# EasyEDA Pro project stm32f401rct6v2.eprj, schematic STM32F401RCT6V2W5500

## Sheets
1 P1: Create Date: 2024-03-25; Page Name: P1; Project Name: stm32f401rct6v2; Schematic Name: STM32F401RCT6V2W5500; Update Date: 2024-06-25; Company: 嘉立创EDA; Page Size: A4; Version: V1.0
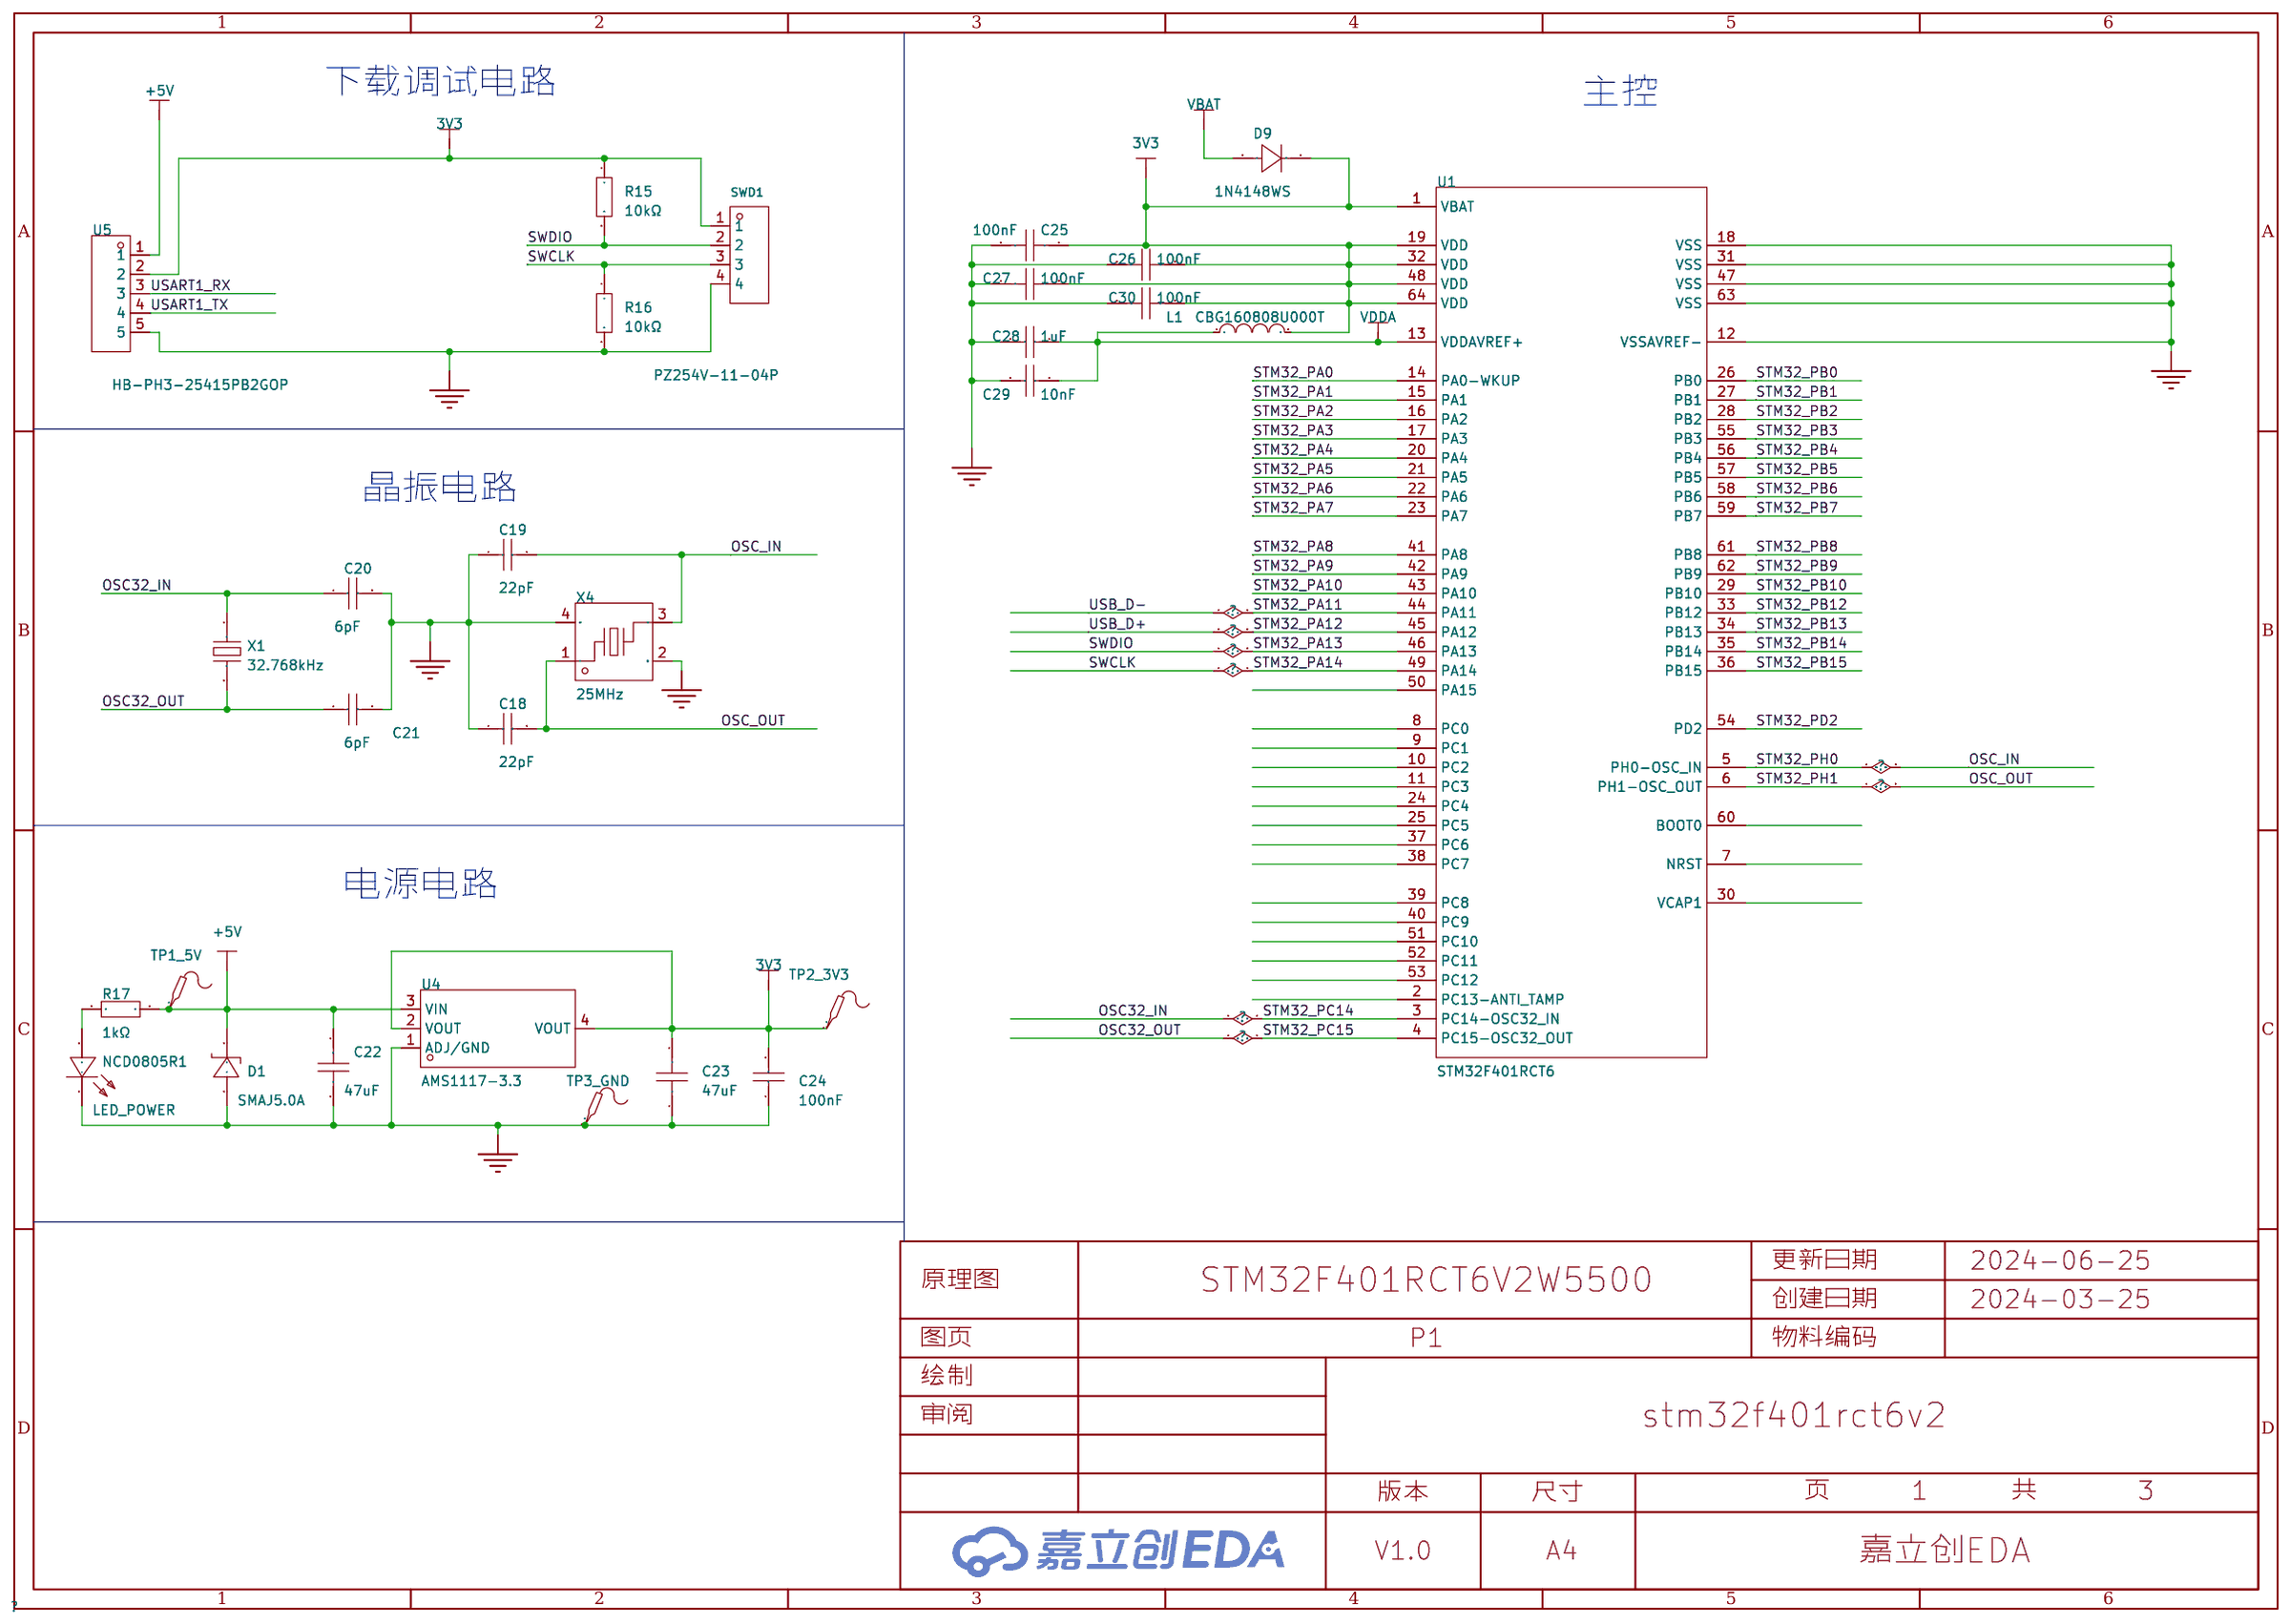
[diagram p1: P1]
2 P2: Page Name: P2; Update Date: 2024-05-12
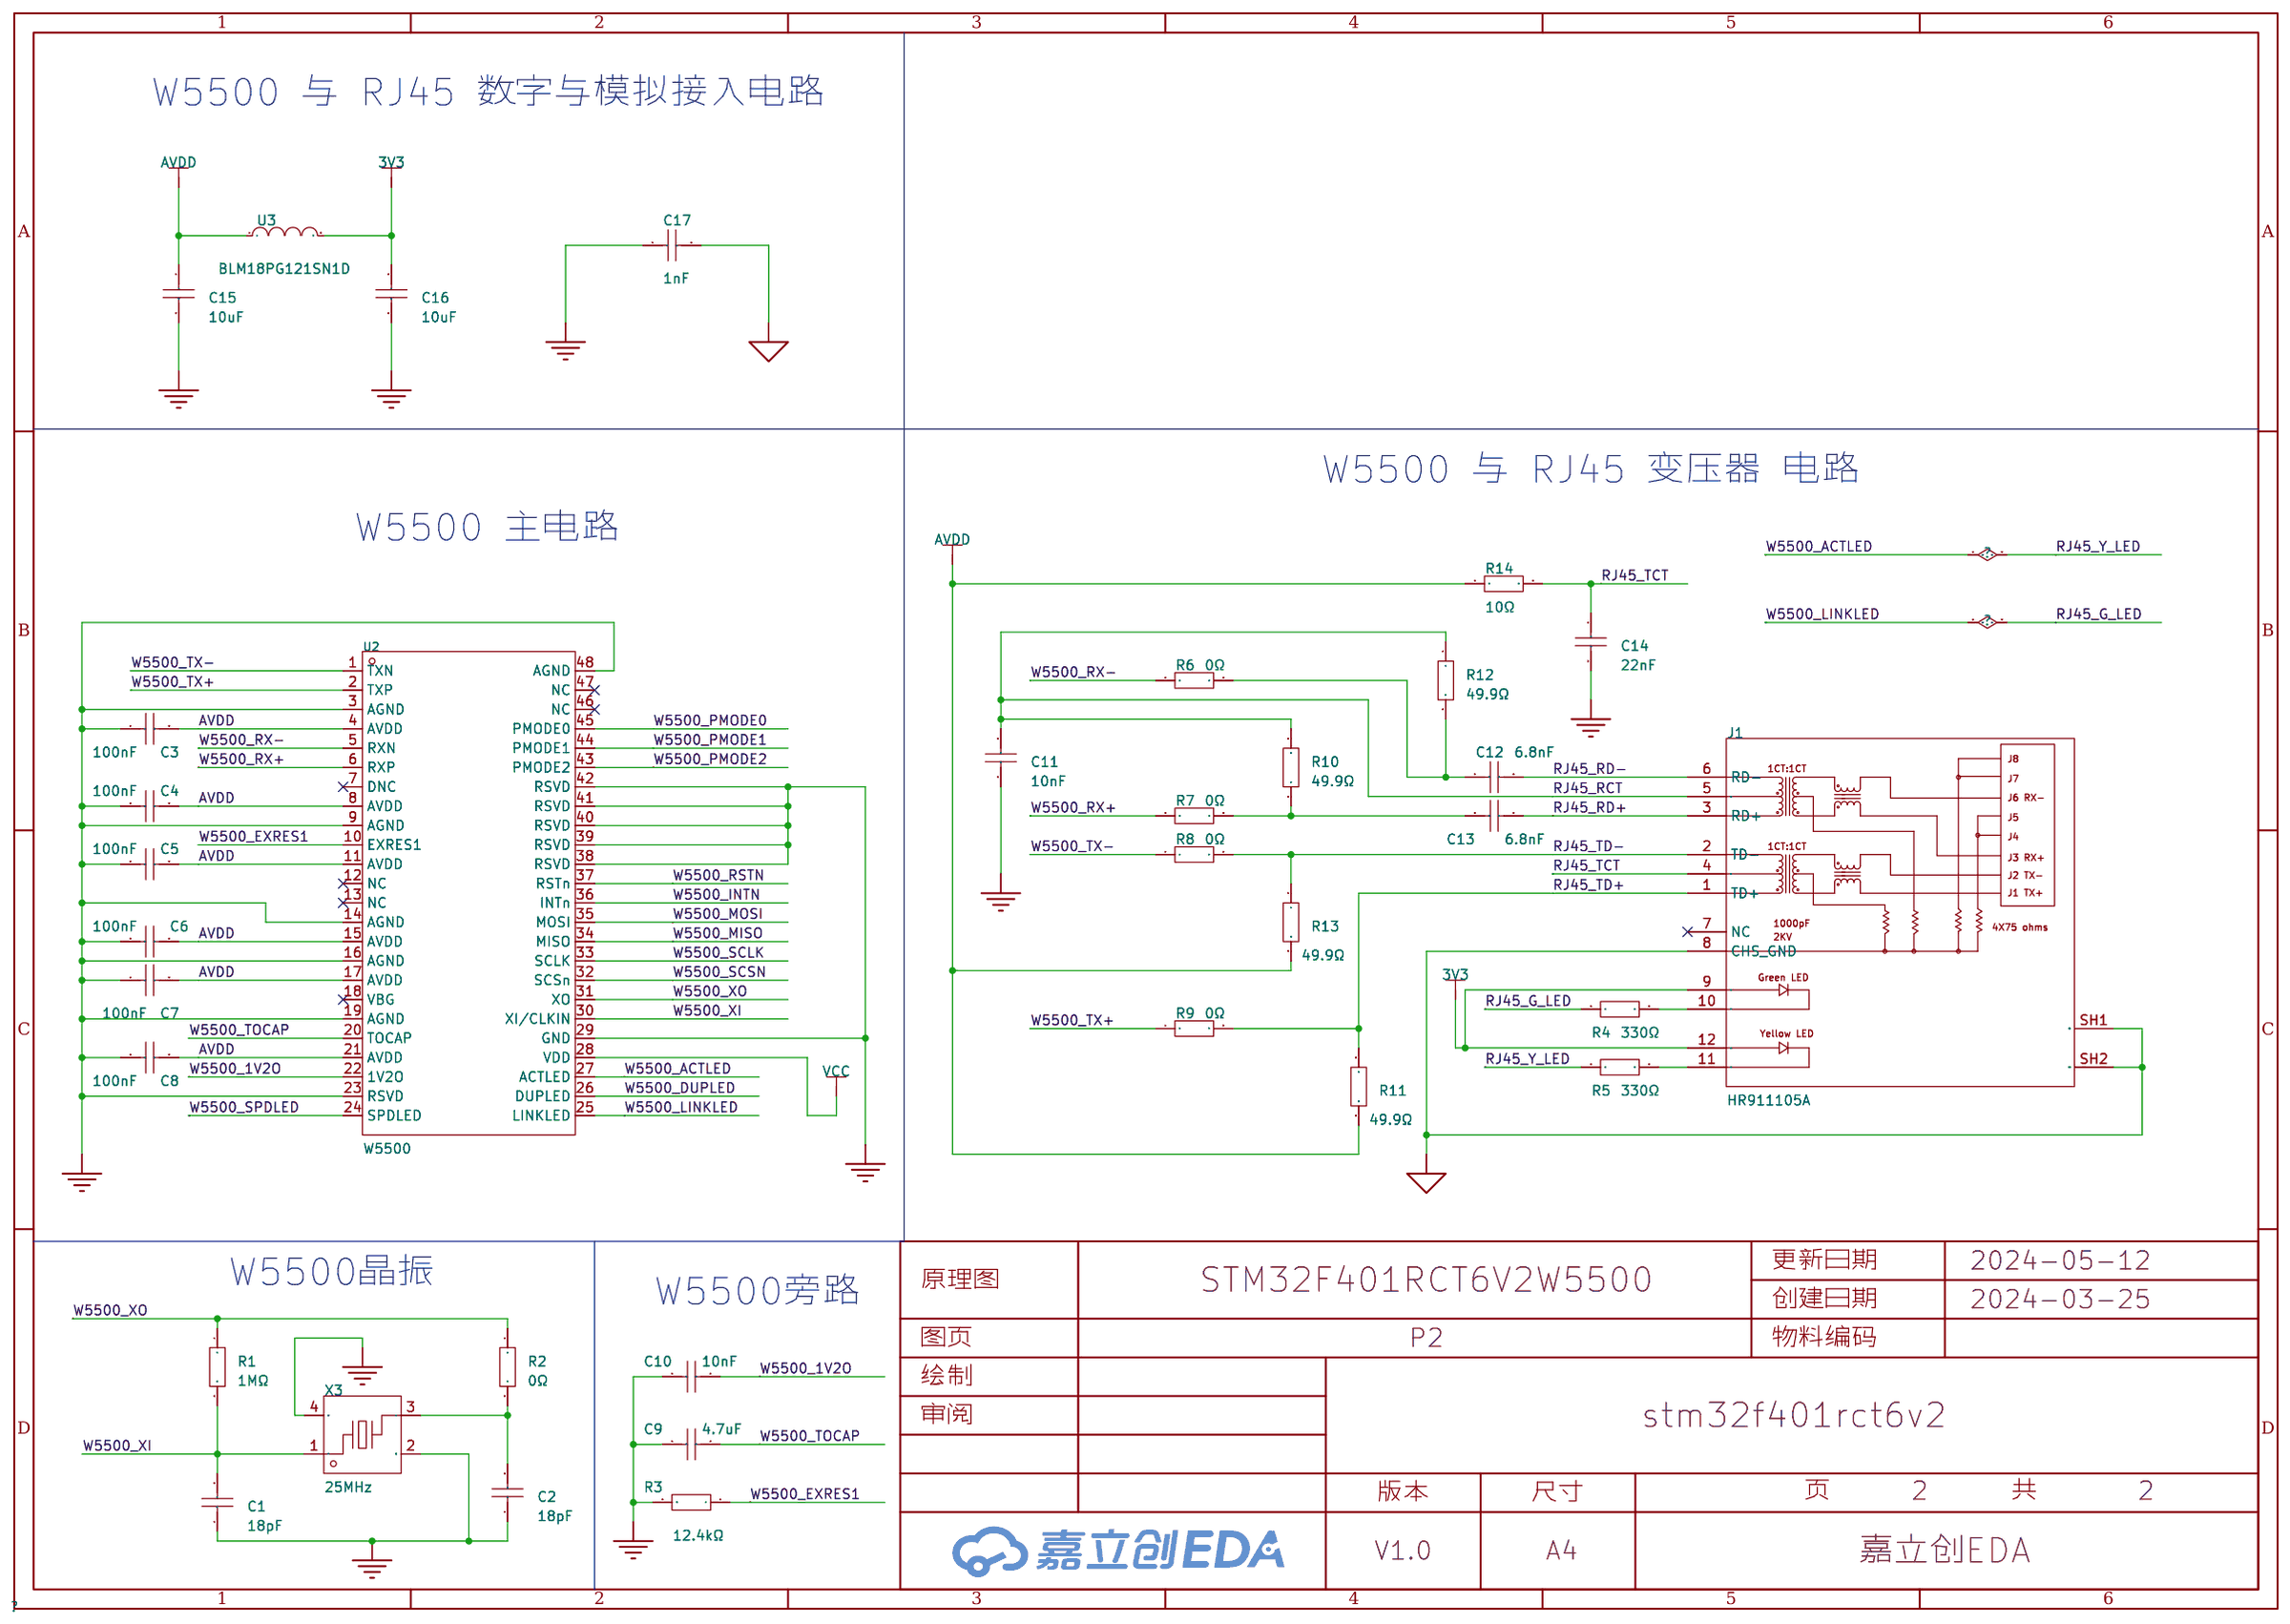
[diagram p2: P2]
3 P3: Create Date: 2024-06-23; Page Name: P3; Update Date: 2024-06-24
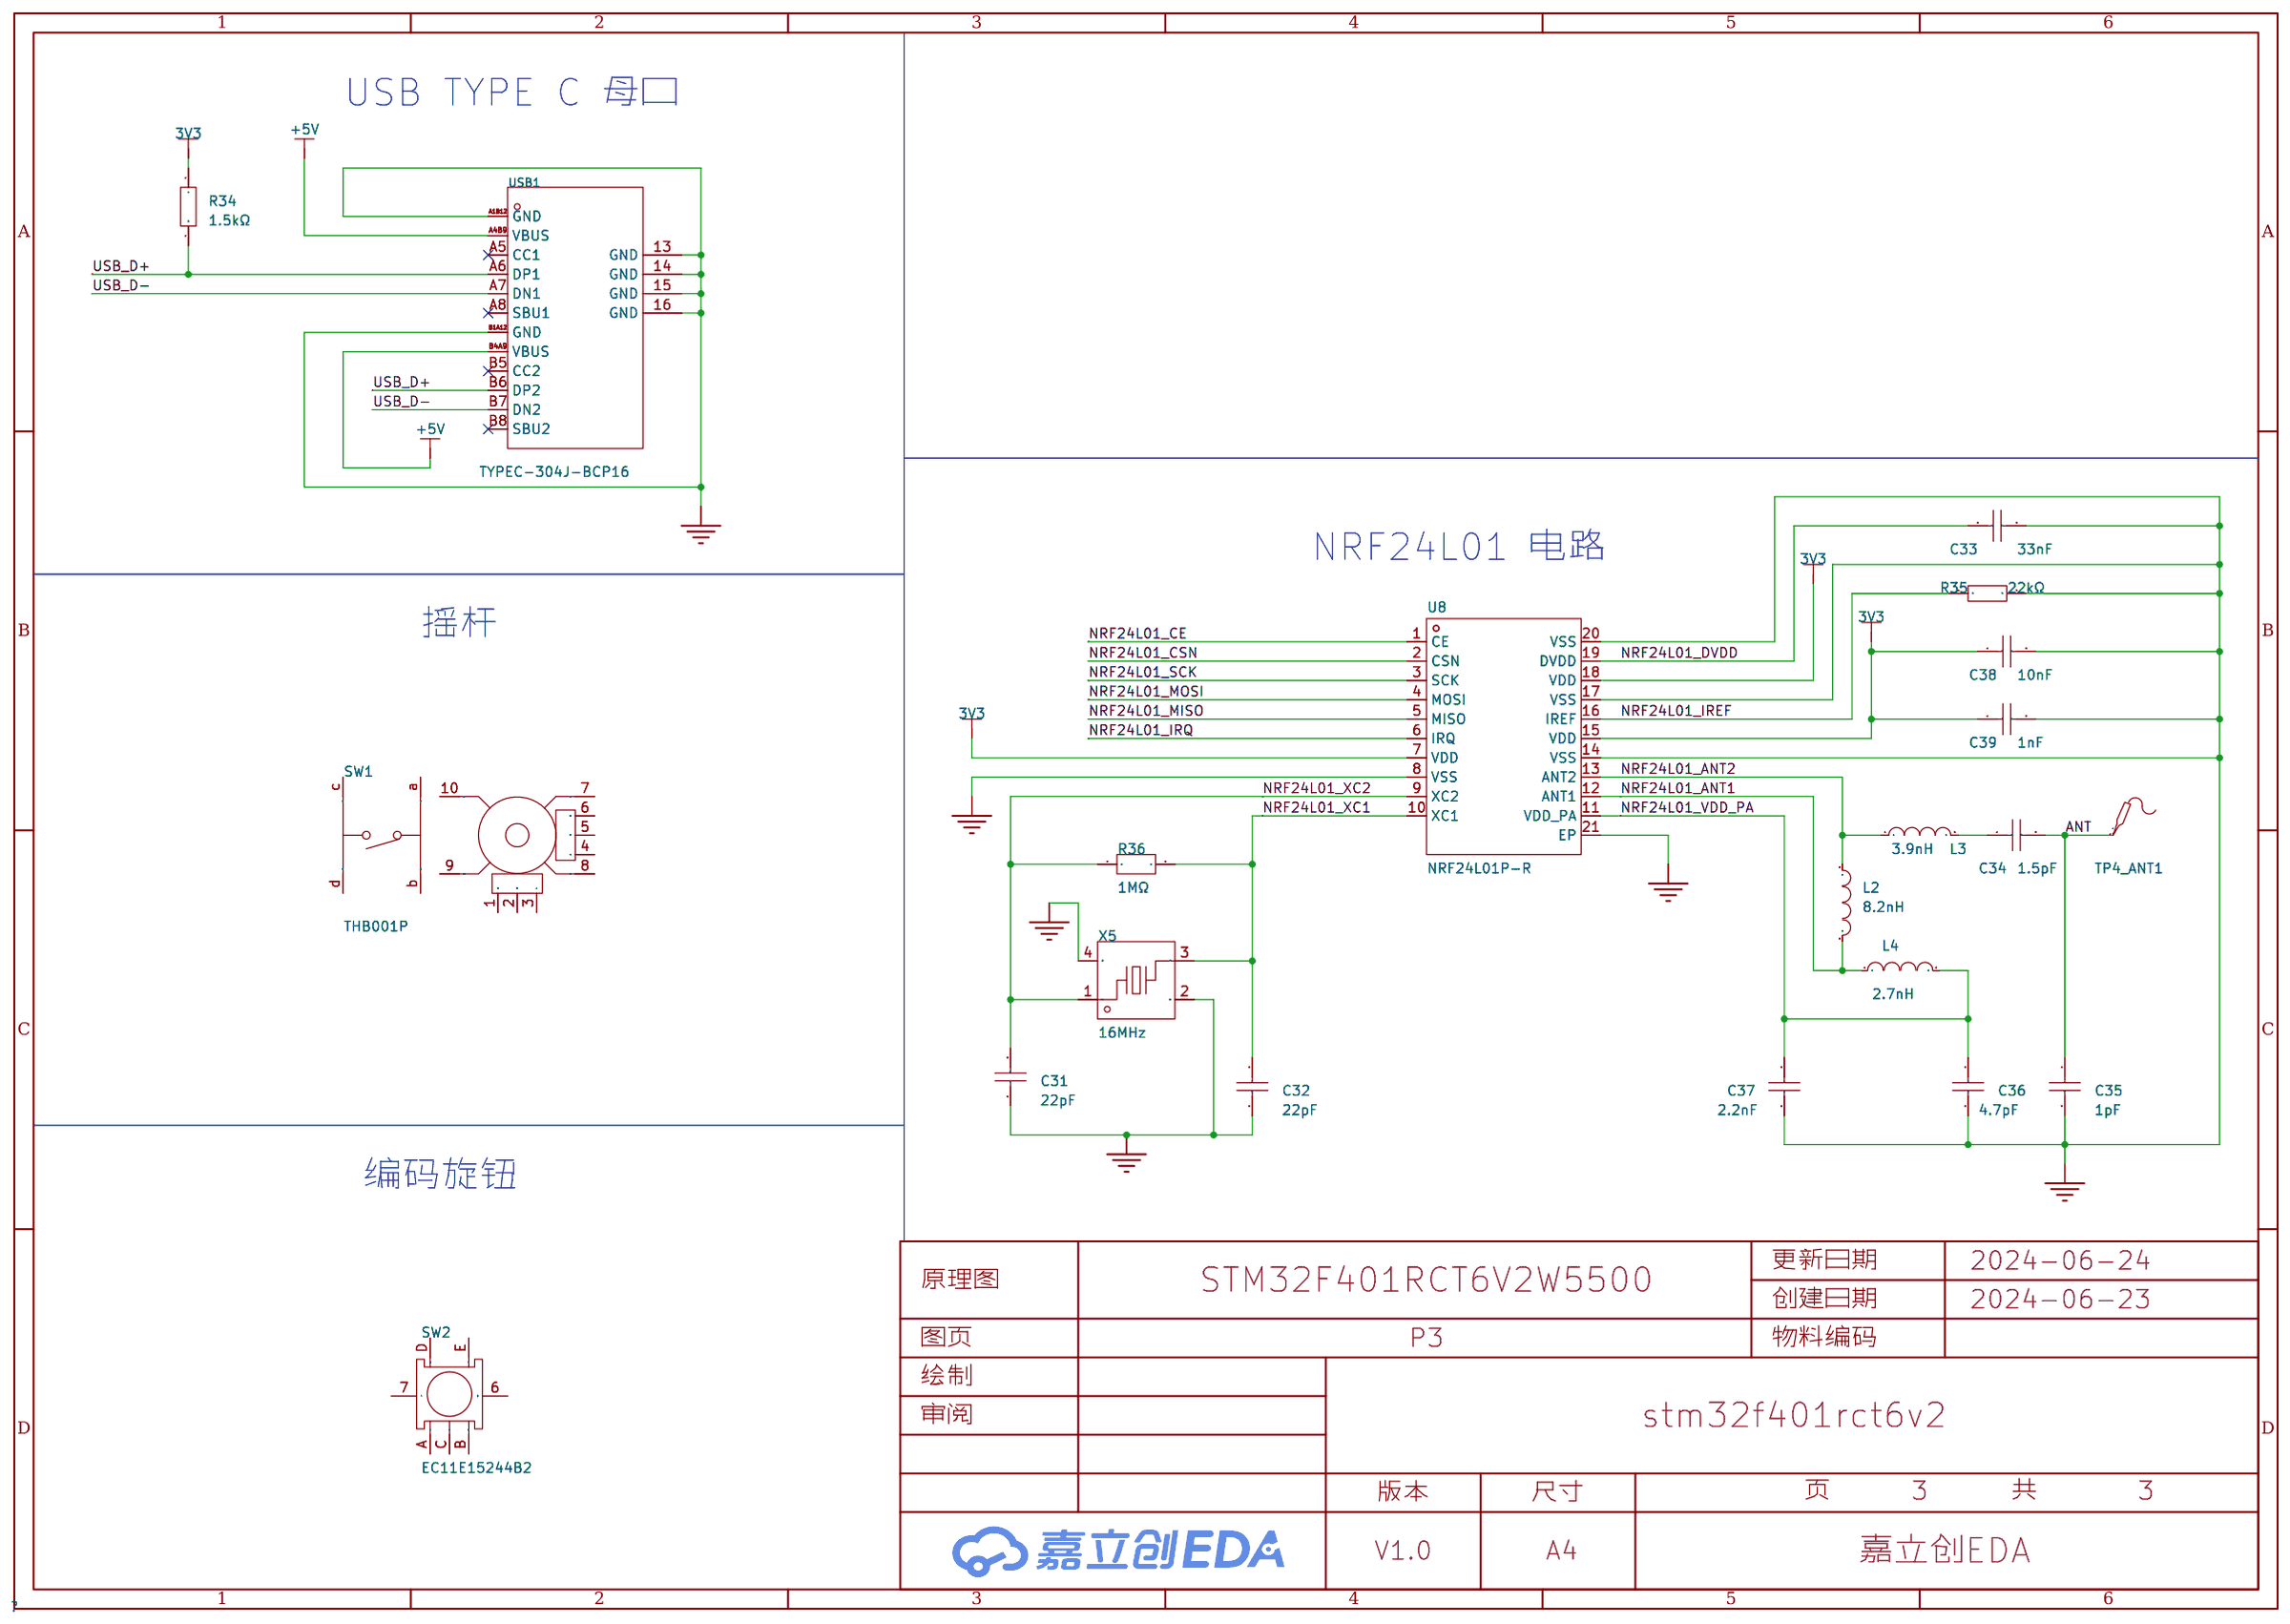
[diagram p3: P3]

## Parts
sheet P1
C18  22pF  [C0603]
C19  22pF  [C0603]
C20  6pF  [C0603]
C21  6pF  [C0603]
C22  47uF  [C1206]
C23  47uF  [C1206]
C24  100nF  [C1206]
C25  100nF  [C0603]
C26  100nF  [C0603]
C27  100nF  [C0603]
C28  1uF  [C0603]
C29  10nF  [C0603]
C30  100nF  [C0603]
D1  SMAJ5.0A  [SMA_L4.3-W2.6-LS5.2-RD]
D9  1N4148WS  [SOD-323_L1.8-W1.3-LS2.5-RD]
L1  CBG160808U000T  [L0603]
LED_POWER  NCD0805R1  [LED0805-R-RD]
R15  10kΩ  [R0603]
R16  10kΩ  [R0603]
R17  1kΩ  [R0603]
SWD1  PZ254V-11-04P  [HDR-TH_4P-P2.54-V-M]
TP1_5V  -  [Test-Point-0.5mm]
TP2_3V3  -  [Test-Point-0.5mm]
TP3_GND  -  [Test-Point-0.5mm]
U1  STM32F401RCT6  [LQFP-64_L10.0-W10.0-P0.50-LS12.0-BL]
U4  AMS1117-3.3  [SOT-223_L6.5-W3.5-P2.30-LS7.0-BR]
U5  HB-PH3-25415PB2GOP  [HDR-TH_5P-P2.54-V-M]
X1  32.768kHz  [OSC-SMD_L3.2-W1.5]
X4  25MHz  [CRYSTAL-SMD_4P-L3.2-W2.5-BL]
sheet P2
C1  18pF  [C0603]
C2  18pF  [C0603]
C3  100nF  [C0603]
C4  100nF  [C0603]
C5  100nF  [C0603]
C6  100nF  [C0603]
C7  100nF  [C0603]
C8  100nF  [C0603]
C9  4.7uF  [C0603]
C10  10nF  [C0603]
C11  10nF  [C0603]
C12  6.8nF  [C0603]
C13  6.8nF  [C0603]
C14  22nF  [C0603]
C15  10uF  [C1206]
C16  10uF  [C1206]
C17  1nF  [C1206]
J1  HR911105A  [RJ45-TH_HR911105A]
R1  1MΩ  [R0603]
R2  0Ω  [R0603]
R3  12.4kΩ  [R0603]
R4  330Ω  [R0603]
R5  330Ω  [R0603]
R6  0Ω  [R0603]
R7  0Ω  [R0603]
R8  0Ω  [R0603]
R9  0Ω  [R0603]
R10  49.9Ω  [R0603]
R11  49.9Ω  [R0603]
R12  49.9Ω  [R0603]
R13  49.9Ω  [R0603]
R14  10Ω  [R0603]
U2  W5500  [LQFP-48_L7.0-W7.0-P0.50-LS9.0-BL]
U3  BLM18PG121SN1D  [L0603]
X3  25MHz  [CRYSTAL-SMD_4P-L3.2-W2.5-BL]
sheet P3
C31  22pF  [C0603]
C32  22pF  [C0603]
C33  33nF  [C0603]
C34  1.5pF  [C0603]
C35  1pF  [C0603]
C36  4.7pF  [C0603]
C37  2.2nF  [C0603]
C38  10nF  [C0603]
C39  1nF  [C0603]
L2  8.2nH  [L0603]
L3  3.9nH  [IND-SMD_L1.6-W0.8-1]
L4  2.7nH  [L0603]
R34  1.5kΩ  [R0603]
R35  22kΩ  [R0603]
R36  1MΩ  [R0603]
SW1  THB001P  [SW-TH_THB001P]
SW2  EC11E15244B2  [SW-TH_EC11XXXXXXXX]
TP4_ANT1  -  [Test-Point-0.5mm]
U8  NRF24L01P-R  [QFN-20_L4.0-W4.0-P0.50-BL-EP]
USB1  TYPEC-304J-BCP16  [USB-C-SMD_TYPEC-304J-BCP16]
X5  16MHz  [CRYSTAL-SMD_4P-L2.0-W1.6-BL]

## Library data of the parts
C18 C19 C31 C32 = CC0603JRNPO9BN220: 容值:22pF;精度:±5%;额定电压:50V;材质(温度系数):NP0;; LCSC Part Name: 22pF ±5% 50V; Supplier Part: C105620; Manufacturer: YAGEO(国巨); Supplier Footprint: 0603; JLCPCB Part Class: 扩展库; Datasheet: https://atta.szlcsc.com/upload/public/pdf/source/20170505/1493957838062.pdf; Supplier: LCSC; Tolerance: ±5%; Voltage Rated: 50V; Temperature Coefficient: NP0
C20 C21 = 0603CG6R0C500NT: 容值:6pF;额定电压:50V;材质(温度系数):C0G;; LCSC Part Name: 6pF 50V ±0.25pF; Supplier Part: C37474; Manufacturer: FH(风华); Supplier Footprint: 0603; JLCPCB Part Class: 扩展库; Datasheet: https://atta.szlcsc.com/upload/public/pdf/source/20200305/C486355_26A10D38EF8C2A5C37091D0039909270.pdf; Supplier: LCSC; Voltage Rated: 50V; Temperature Coefficient: C0G
C22 C23 = GRM31CR61E476ME44L: 容值:47uF;精度:±20%;额定电压:25V;材质(温度系数):X5R;; LCSC Part Name: 47uF ±20% 25V; Supplier Part: C403725; Manufacturer: muRata(村田); Supplier Footprint: 1206; JLCPCB Part Class: 扩展库; Datasheet: https://atta.szlcsc.com/upload/public/pdf/source/20191025/C403725_B8A8CD2FFA1F57E6FDF268BD106459D5.pdf; Supplier: LCSC; Tolerance: ±20%; Voltage Rated: 25V; Temperature Coefficient: X5R
C24 = CL31B104KBCNNNC: 容值:100nF;精度:±10%;额定电压:50V;材质(温度系数):X7R;; LCSC Part Name: 100nF ±10% 50V; Supplier Part: C24497; Manufacturer: SAMSUNG(三星); Supplier Footprint: 1206; JLCPCB Part Class: 基础库; Datasheet: https://atta.szlcsc.com/upload/public/pdf/source/20160218/1457707763339.pdf; Supplier: LCSC; Tolerance: ±10%; Voltage Rated: 50V; Temperature Coefficient: X7R
C25-C27 C30 = CC0603KRX7R9BB104: 容值:100nF;精度:±10%;额定电压:50V;材质(温度系数):X7R;; LCSC Part Name: 100nF ±10% 50V; Supplier Part: C14663; Manufacturer: YAGEO(国巨); Supplier Footprint: 0603; JLCPCB Part Class: 基础库; Datasheet: https://atta.szlcsc.com/upload/public/pdf/source/20180910/C282072_33301C7F631E79921B82A8DAC6BCC5B3.pdf; Supplier: LCSC; Tolerance: ±10%; Voltage Rated: 50V; Temperature Coefficient: X7R
C28 = CL10A105KB8NNNC: 容值:1uF;精度:±10%;额定电压:50V;材质(温度系数):X5R;; LCSC Part Name: 1uF ±10% 50V; Supplier Part: C15849; Manufacturer: SAMSUNG(三星); Supplier Footprint: 0603; JLCPCB Part Class: 基础库; Datasheet: https://atta.szlcsc.com/upload/public/pdf/source/20160218/1457707763339.pdf; Supplier: LCSC; Tolerance: ±10%; Voltage Rated: 50V; Temperature Coefficient: X5R
C10 C11 C29 C38 = CC0603KRX7R9BB103: 容值:10nF;精度:±10%;额定电压:50V;材质(温度系数):X7R;; LCSC Part Name: 10nF ±10% 50V; Supplier Part: C100042; Manufacturer: YAGEO(国巨); Supplier Footprint: 0603; JLCPCB Part Class: 扩展库; Datasheet: https://atta.szlcsc.com/upload/public/pdf/source/20181008/C309510_22F155564471FAF6A489F7D68F34234E.pdf; Supplier: LCSC; Tolerance: ±10%; Voltage Rated: 50V; Temperature Coefficient: X7R
D1 = SMAJ5.0A_C10758: 反向截止电压(Vrwm):5V;最大钳位电压:9.2V;峰值脉冲电流(Ipp)@10/1000us:43.5A;击穿电压:6.4V;; LCSC Part Name: 单向TVS 5V截止 43.5A峰值脉冲; Supplier Part: C10758; Manufacturer: RUILON(瑞隆源); Supplier Footprint: SMA(DO-214AC); JLCPCB Part Class: 扩展库; Datasheet: https://atta.szlcsc.com/upload/public/pdf/source/20180711/C81281_95CC36DD15828E233F5FA92369DBC9C5.pdf; Supplier: LCSC; Reverse Stand-Off Voltage (Vrwm): 5V; Maximum Clamping Voltage: 9.2V; Peak Pulse Current (Ipp)@10/1000us: 43.5A; Breakdown Voltage: 6.4V; Type: TVS
D9 = 1N4148WS_C917117: 二极管配置:独立式;正向压降(Vf):1.25V@150mA;直流反向耐压(Vr):100V;平均整流电流(Io):300mA;功率:400mW;反向恢复时间(trr):8ns;; LCSC Part Name: 电压:100V 电流:300mA; Supplier Part: C917117; Manufacturer: JSMSEMI(杰盛微); Supplier Footprint: SOD-323; JLCPCB Part Class: 扩展库; Datasheet: https://atta.szlcsc.com/upload/public/pdf/source/20230807/08D9F448A82EA88A23B325A669586A09.pdf; Supplier: LCSC; Diode Configuration: 独立式; Forward Voltage (Vf@If): 1.25V@150mA; Reverse Voltage (Vr): 100V; Average Rectified Current (Io): 300mA; Power Dissipation: 400mW; Reverse Leakage Current: 1uA@75V; Reverse Recovery Time (trr): 8ns; Operating Temperature: -55℃~+150℃@(Tj)
L1 = CBG160808U000T: 标称阻抗@测试频率:0Ω@100MHz;直流电阻(RDC):100mΩ;; LCSC Part Name: 单路 0603磁珠 阻抗0Ω@100MHz; Supplier Part: C43163; Manufacturer: FH(风华); Supplier Footprint: 0603; JLCPCB Part Class: 扩展库; Datasheet: https://atta.szlcsc.com/upload/public/pdf/source/20190129/C361667_1614D407CC98D1D3CFBD9E1F7511C14D.pdf; Supplier: LCSC; Impedance @ Frequency: 0Ω@100MHz; DC Resistance: 100mΩ; Current Rating: 800mA; Circuits: 1
LED_POWER = NCD0805R1: 灯头类型:-;发光颜色:红色;正向电压(VF):1.6V~2.6V;功率:65mW;正向电流:20mA;主波长:615nm~630nm;二极管配置:独立二极管;透镜颜色:无色透明;色温:-;发光强度:67mcd~195mcd;发光角度:130°;载带方式:-;工作温度:-30℃~+85℃;; Supplier Part: C84256; Manufacturer: 国星光电; Supplier Footprint: 0805; JLCPCB Part Class: 基础库; Datasheet: https://atta.szlcsc.com/upload/public/pdf/source/20200820/C84256_F0A75A43B3EAD75808600A0514C76B99.pdf; Supplier: LCSC; Emitted Color: 红色; Forward Voltage (VF): 1.6V~2.6V; Power Dissipation: 65mW; Forward Current: 20mA; Dominant Wavelength: 615nm~630nm; Diode Configuration: 独立二极管; Lens Color: 无色透明; Luminous Intensity: 67mcd~195mcd; Viewing Angle: 130°; Operating Temperature: -30℃~+85℃
R15 R16 = 0603WAF1002T5E: 电阻类型:厚膜电阻;阻值:10kΩ;精度:±1%;功率:100mW;最大工作电压:75V;温度系数:±100ppm/℃;; LCSC Part Name: 10kΩ ±1% 100mW 厚膜电阻; Supplier Part: C25804; Manufacturer: UNI-ROYAL(厚声); Supplier Footprint: 0603; JLCPCB Part Class: 基础库; Datasheet: https://atta.szlcsc.com/upload/public/pdf/source/20200306/C422600_1E6D84923E4A46A82E41ADD87F860B5C.pdf; Supplier: LCSC; Type: 厚膜电阻; Tolerance: ±1%; Power(Watts): 100mW; Overload Voltage (Max): 75V; Temperature Coefficient: ±100ppm/℃; Operating Temperature Range: -55℃~+155℃
R17 = RC0603FR-071KL: 电阻类型:厚膜电阻;阻值:1kΩ;精度:±1%;功率:100mW;; LCSC Part Name: 1kΩ ±1% 100mW; Supplier Part: C22548; Manufacturer: YAGEO(国巨); Supplier Footprint: 0603; JLCPCB Part Class: 扩展库; Datasheet: https://atta.szlcsc.com/upload/public/pdf/source/20180312/7BD3618A8B6324EA6280B0497A051AB7.pdf; Supplier: LCSC; Type: 厚膜电阻; Tolerance: ±1%; Power(Watts): 100mW; Temperature Coefficient: ±100ppm/℃; Overload Voltage (Max): 75V; Operating Temperature Range: -55℃~+155℃
SWD1 = PZ254V-11-04P: 排数:单排;总PIN位数:4P;间距:2.54mm;插针结构:1x4P;行距:-;安装类型:直插;圆针/方针:方针;额定电流:3A;额定电压:250V;配合针长度:6mm;塑高:2.5mm;端接针长度:3mm;触头材质:-;工作温度范围:-40℃~+105℃;颜色:黑色;; LCSC Part Name: 2.54mm 1x4P 直插 方针; Supplier Part: C2691448; Manufacturer: XFCN(兴飞); Supplier Footprint: 插件,P=2.54mm; JLCPCB Part Class: 扩展库; Datasheet: https://atta.szlcsc.com/upload/public/pdf/source/20200309/C492403_F9F19131791D08044AD4F84F8E751A34.pdf; Supplier: LCSC; Number of Rows: 单排; Number of Pins: 4P; Pitch: 2.54mm; Pin Structure: 1x4P; Mounting Type: 直插; Circluar Pins/Square Pins: 方针; Current Rating (Max): 3A; Voltage Rating (Max): 250V; Length of Mating Pin: 6mm; Insulation Height: 2.5mm; Length of End Connection Pin: 3mm; Operating Temperature Range: -40℃~+105℃; Color: 黑色
TP1_5V TP2_3V3 TP3_GND TP4_ANT1 = Test-Point: Test Point 测试点
U1 = STM32F401RCT6: CPU内核:CM4;程序存储容量:256KB;RAM总容量:64KB;GPIO端口数量:50;工作电压范围:1.7V~3.6V;CPU最大主频:84MHz;程序存储器类型:FLASH;; Supplier Part: C74524; Manufacturer: ST(意法半导体); Supplier Footprint: LQFP-64(10x10); JLCPCB Part Class: 扩展库; Datasheet: https://atta.szlcsc.com/upload/public/pdf/source/20170712/C118825_1499827770838813456.pdf; Supplier: LCSC; CPU Core: CM4; Program Storage Size: 256KB; RAM Size: 64KB; GPIO Ports Number: 50; Operating Voltage Range: 1.7V~3.6V; CPU Maximum Speed: 84MHz; Program Memory Type: FLASH; Operating Temperature Range: -40℃~+85℃; ADC (Bit): 12bit; Universal Serial Bus: 有; Peripheral/Function: PWM；PWM; Watchdog: 有; Infrared Data Association: 有; Low-Voltage Detect: 有; Secure Digital Input and Output: 有; Direct Memory Access: 有; Internal Oscillator: 有
U4 = AMS1117-3.3_C426566: 输出类型:固定;最大输入电压:18V;输出电压:3.3V;输出电流:1A;电源纹波抑制比(PSRR):70dB@(120Hz);输出极性:正;; LCSC Part Name: 输入18V 输出3.3V 1A; Supplier Part: C426566; Manufacturer: Slkor(萨科微); Supplier Footprint: SOT-223; JLCPCB Part Class: 扩展库; Datasheet: https://atta.szlcsc.com/upload/public/pdf/source/20201231/C426566_7F22DB93439D00F3FA27143E4F28C6AA.pdf; Supplier: LCSC; Output Type: 固定; Maximum Input Voltage: 18V; Output Voltage: 3.3V; Output Current: 1A; Power Supply Rejection Ratio (PSRR): 70dB@(120Hz); Dropout Voltage: 1.4V@(1A); Output Polarity: 正; Number of Outputs: 1
U5 = HB-PH3-25415PB2GOP: 插针结构:1x5P;间距:2.54mm;行距:2.54mm;圆针/方针:方针;安装类型:直插;排数:单排;总PIN位数:5P;额定电流:3A;额定电压:250V;配合针长度:6mm;塑高:2.54mm;端接针长度:3mm;触头材质:黄铜;触头镀层:金;工作温度范围:-40℃~+105℃;焊接温度(最大值):260℃;颜色:黑色;; LCSC Part Name: 间距:2.54mm 1x5P 直插 方针; Supplier Part: C6332198; Manufacturer: HANBO(汉博); Supplier Footprint: 插件,P=2.54mm; JLCPCB Part Class: 扩展库; Datasheet: https://atta.szlcsc.com/upload/public/pdf/source/20230803/F72D259687963761DF1B552F3BB84A31.pdf; Supplier: LCSC; Pin Structure: 1x5P; Pitch: 2.54mm; Row Spacing: 2.54mm; Circluar Pins/Square Pins: 方针; Mounting Type: 直插; Number of Rows: 单排; Number of Pins: 5P; Current Rating (Max): 3A; Voltage Rating (Max): 250V; Length of Mating Pin: 6mm; Insulation Height: 2.54mm; Length of End Connection Pin: 3mm; Contact Material: 黄铜; Contact Plating: 金; Operating Temperature Range: -40℃~+105℃; Soldering Temperature(Max): 260℃; Color: 黑色
X1 = X321532768KGD2SI: 频率:32.768kHz;负载电容:12.5pF;频率公差:±20ppm;; LCSC Part Name: 32.768kHz ±20ppm 12.5pF YST310S; Supplier Part: C620155; Manufacturer: YXC(扬兴晶振); Supplier Footprint: SMD3215-2P; JLCPCB Part Class: 扩展库; Datasheet: https://atta.szlcsc.com/upload/public/pdf/source/20210329/C620155_E5A74FC0D27C5E9015A8D75DE9484FEA.pdf; Supplier: LCSC; Crystal Type: 贴片无源晶振; Load Capacitance: 12.5pF; Frequency Tolerance: ±20ppm; Operating Temperature: -40℃~+85℃
X3 X4 = XL2EL89CSI-111YLC-25M: 频率:25MHz;负载电容:20pF;频率公差:±10ppm;; LCSC Part Name: 25MHz ±10ppm 20pF YSX321SL; Supplier Part: C5280577; Manufacturer: YXC(扬兴晶振); Supplier Footprint: SMD3225-4P; JLCPCB Part Class: 扩展库; Datasheet: https://atta.szlcsc.com/upload/public/pdf/source/20221123/8DAA01809C4E3F159850A71277C18D74.pdf; Supplier: LCSC; Crystal Type: 贴片无源晶振; Load Capacitance: 20pF; Frequency Tolerance: ±10ppm
C1 C2 = CC0603JRNPO9BN180: 容值:18pF;精度:±5%;额定电压:50V;材质(温度系数):NP0;; LCSC Part Name: 18pF ±5% 50V; Supplier Part: C107040; Manufacturer: YAGEO(国巨); Supplier Footprint: 0603; JLCPCB Part Class: 扩展库; Datasheet: https://atta.szlcsc.com/upload/public/pdf/source/20170914/C128857_1505359892143968080.pdf; Supplier: LCSC; Tolerance: ±5%; Voltage Rated: 50V; Temperature Coefficient: NP0
C3-C8 = 0603B104K500NT: 容值:100nF;精度:±10%;额定电压:50V;材质(温度系数):X7R;; LCSC Part Name: 100nF ±10% 50V; Supplier Part: C30926; Manufacturer: FH(风华); Supplier Footprint: 0603; JLCPCB Part Class: 扩展库; Datasheet: https://atta.szlcsc.com/upload/public/pdf/source/20200305/C486355_26A10D38EF8C2A5C37091D0039909270.pdf; Supplier: LCSC; Tolerance: ±10%; Voltage Rated: 50V; Temperature Coefficient: X7R
C9 = CL10A475KO8NNNC: 容值:4.7uF;精度:±10%;额定电压:16V;材质(温度系数):X5R;; LCSC Part Name: 4.7uF ±10% 16V; Supplier Part: C19666; Manufacturer: SAMSUNG(三星); Supplier Footprint: 0603; JLCPCB Part Class: 基础库; Datasheet: https://atta.szlcsc.com/upload/public/pdf/source/20160218/1457707763339.pdf; Supplier: LCSC; Tolerance: ±10%; Voltage Rated: 16V; Temperature Coefficient: X5R
C12 C13 = 0603B682K500NT: 容值:6.8nF;精度:±10%;额定电压:50V;材质(温度系数):X7R;; LCSC Part Name: 6.8nF ±10% 50V; Supplier Part: C1631; Manufacturer: FH(风华); Supplier Footprint: 0603; JLCPCB Part Class: 基础库; Datasheet: https://atta.szlcsc.com/upload/public/pdf/source/20200305/C486355_26A10D38EF8C2A5C37091D0039909270.pdf; Supplier: LCSC; Tolerance: ±10%; Voltage Rated: 50V; Temperature Coefficient: X7R
C14 = 0603B223K500NT: 容值:22nF;精度:±10%;额定电压:50V;材质(温度系数):X7R;; LCSC Part Name: 22nF ±10% 50V; Supplier Part: C77571; Manufacturer: FH(风华); Supplier Footprint: 0603; JLCPCB Part Class: 扩展库; Datasheet: https://atta.szlcsc.com/upload/public/pdf/source/20200305/C486355_26A10D38EF8C2A5C37091D0039909270.pdf; Supplier: LCSC; Tolerance: ±10%; Voltage Rated: 50V; Temperature Coefficient: X7R
C15 C16 = CL31A106KAHNNNE: 容值:10uF;精度:±10%;额定电压:25V;材质(温度系数):X5R;; LCSC Part Name: 10uF ±10% 25V; Supplier Part: C9807; Manufacturer: SAMSUNG(三星); Supplier Footprint: 1206; JLCPCB Part Class: 扩展库; Datasheet: https://atta.szlcsc.com/upload/public/pdf/source/20160218/1457707763339.pdf; Supplier: LCSC; Tolerance: ±10%; Voltage Rated: 25V; Temperature Coefficient: X5R
C17 = 1206B102K202NT: 容值:1nF;精度:±10%;额定电压:2kV;材质(温度系数):X7R;; LCSC Part Name: 1nF ±10% 2kV; Supplier Part: C9196; Manufacturer: FH(风华); Supplier Footprint: 1206; JLCPCB Part Class: 基础库; Datasheet: https://atta.szlcsc.com/upload/public/pdf/source/20200305/C486355_26A10D38EF8C2A5C37091D0039909270.pdf; Supplier: LCSC; Tolerance: ±10%; Voltage Rated: 2kV; Temperature Coefficient: X7R
J1 = HR911105A_C12074: 连接器类型:RJ插座;USOC代码:RJ45;端口数量:1;屏蔽:-;LED:带LED;等级:-;; LCSC Part Name: RJ45 带LED; Supplier Part: C12074; Manufacturer: HANRUN(汉仁); Supplier Footprint: 插件; JLCPCB Part Class: 扩展库; Datasheet: https://atta.szlcsc.com/upload/public/pdf/source/20170918/C12074_1505726819496976146.pdf; Supplier: LCSC; Connector Type: RJ插座; USOC Codes: RJ45; Number of Ports: 1; LED: 带LED
R1 = 0603WAF1004T5E: 电阻类型:厚膜电阻;阻值:1MΩ;精度:±1%;功率:100mW;最大工作电压:75V;温度系数:±100ppm/℃;; LCSC Part Name: 1MΩ ±1% 100mW 厚膜电阻; Supplier Part: C22935; Manufacturer: UNI-ROYAL(厚声); Supplier Footprint: 0603; JLCPCB Part Class: 基础库; Datasheet: https://atta.szlcsc.com/upload/public/pdf/source/20200306/C422600_1E6D84923E4A46A82E41ADD87F860B5C.pdf; Supplier: LCSC; Type: 厚膜电阻; Tolerance: ±1%; Power(Watts): 100mW; Overload Voltage (Max): 75V; Temperature Coefficient: ±100ppm/℃; Operating Temperature Range: -55℃~+155℃
R2 R6-R9 = 0603WAF0000T5E: 电阻类型:厚膜电阻;阻值:0Ω;精度:±1%;功率:100mW;最大工作电压:75V;; LCSC Part Name: 0Ω ±1% 100mW 厚膜电阻; Supplier Part: C21189; Manufacturer: UNI-ROYAL(厚声); Supplier Footprint: 0603; JLCPCB Part Class: 基础库; Datasheet: https://atta.szlcsc.com/upload/public/pdf/source/20200306/C422600_1E6D84923E4A46A82E41ADD87F860B5C.pdf; Supplier: LCSC; Type: 厚膜电阻; Tolerance: ±1%; Power(Watts): 100mW; Overload Voltage (Max): 75V; Operating Temperature Range: -55℃~+155℃
R3 = 0603WAF1242T5E: 电阻类型:厚膜电阻;阻值:12.4kΩ;精度:±1%;功率:100mW;最大工作电压:75V;温度系数:±100ppm/℃;; LCSC Part Name: 12.4kΩ ±1% 100mW 厚膜电阻; Supplier Part: C22865; Manufacturer: UNI-ROYAL(厚声); Supplier Footprint: 0603; JLCPCB Part Class: 扩展库; Datasheet: https://atta.szlcsc.com/upload/public/pdf/source/20200306/C422600_1E6D84923E4A46A82E41ADD87F860B5C.pdf; Supplier: LCSC; Type: 厚膜电阻; Tolerance: ±1%; Power(Watts): 100mW; Overload Voltage (Max): 75V; Temperature Coefficient: ±100ppm/℃; Operating Temperature Range: -55℃~+155℃
R4 R5 = 0603WAF3300T5E: 阻值:330Ω;精度:±1%;功率:100mW;温度系数:±100ppm/℃;电阻类型:厚膜电阻;; LCSC Part Name: 330Ω ±1% 100mW 厚膜电阻; Supplier Part: C23138; Manufacturer: UNI-ROYAL(厚声); Supplier Footprint: 0603; JLCPCB Part Class: 基础库; Datasheet: https://atta.szlcsc.com/upload/public/pdf/source/20200306/C422600_1E6D84923E4A46A82E41ADD87F860B5C.pdf; Supplier: LCSC; Tolerance: ±1%; Power(Watts): 100mW; Overload Voltage (Max): 75V; Temperature Coefficient: ±100ppm/℃; Type: 厚膜电阻; Operating Temperature Range: -55℃~+155℃
R10-R13 = RMS06FT49R9: 电阻类型:厚膜电阻;阻值:49.9Ω;精度:±1%;功率:100mW;最大工作电压:50V;温度系数:±100ppm/℃;; LCSC Part Name: 厚膜电阻 49.9Ω ±1% 100mW; Supplier Part: C209157; Manufacturer: 大毅科技; Supplier Footprint: 0603; JLCPCB Part Class: 扩展库; Datasheet: https://atta.szlcsc.com/upload/public/pdf/source/20190313/C209057_DB28D2F9A2E1A0AF6BB7AAA99A28D7CC.pdf; Supplier: LCSC; Type: 厚膜电阻; Tolerance: ±1%; Power(Watts): 100mW; Overload Voltage (Max): 50V; Temperature Coefficient: ±100ppm/℃; Operating Temperature Range: -55℃~+155℃
R14 = 0603WAF100JT5E: 电阻类型:厚膜电阻;阻值:10Ω;精度:±1%;功率:100mW;最大工作电压:75V;温度系数:±400ppm/℃;; LCSC Part Name: 10Ω ±1% 100mW 厚膜电阻; Supplier Part: C22859; Manufacturer: UNI-ROYAL(厚声); Supplier Footprint: 0603; JLCPCB Part Class: 基础库; Datasheet: https://atta.szlcsc.com/upload/public/pdf/source/20200306/C422600_1E6D84923E4A46A82E41ADD87F860B5C.pdf; Supplier: LCSC; Type: 厚膜电阻; Tolerance: ±1%; Power(Watts): 100mW; Overload Voltage (Max): 75V; Temperature Coefficient: ±400ppm/℃; Operating Temperature Range: -55℃~+155℃
U2 = W5500: 应用功能:控制器;通道数:-;接口类型:SPI;; LCSC Part Name: 硬连线TCP/IP嵌入式以太网控制器; Supplier Part: C32843; Manufacturer: WIZNET; Supplier Footprint: LQFP-48(7x7); JLCPCB Part Class: 扩展库; Datasheet: https://atta.szlcsc.com/upload/public/pdf/source/20230714/E10C32B058E0BA54FCE1C1556BE10C07.pdf; Supplier: LCSC; Application Function: 控制器; Interface: SPI; Supply Voltage: 2.97V~3.63V; Supply Current: 132mA; Operating Temperature: -40℃~+85℃
U3 = BLM18PG121SN1D: 标称阻抗@测试频率:120Ω@100MHz;误差:±25%;直流电阻(RDC):50mΩ;; LCSC Part Name: 单路 0603磁珠 阻抗120Ω@100MHz; Supplier Part: C14709; Manufacturer: muRata(村田); Supplier Footprint: 0603; JLCPCB Part Class: 扩展库; Datasheet: https://atta.szlcsc.com/upload/public/pdf/source/20130704/1457706621422.pdf; Supplier: LCSC; Impedance @ Frequency: 120Ω@100MHz; Tolerance: ±25%; DC Resistance: 50mΩ; Current Rating: 2A; Circuits: 1
C33 = CL10B333KB8NNNC: 容值:33nF;精度:±10%;额定电压:50V;材质(温度系数):X7R;; LCSC Part Name: 33nF ±10% 50V; Supplier Part: C21117; Manufacturer: SAMSUNG(三星); Supplier Footprint: 0603; JLCPCB Part Class: 基础库; Datasheet: https://atta.szlcsc.com/upload/public/pdf/source/20160218/1457707763339.pdf; Supplier: LCSC; Tolerance: ±10%; Voltage Rated: 50V; Temperature Coefficient: X7R
C34 = 0603CG1R5C500NT: 容值:1.5pF;额定电压:50V;材质(温度系数):C0G;; LCSC Part Name: 1.5pF 50V; Supplier Part: C1639; Manufacturer: FH(风华); Supplier Footprint: 0603; JLCPCB Part Class: 扩展库; Datasheet: https://atta.szlcsc.com/upload/public/pdf/source/20200305/C486355_26A10D38EF8C2A5C37091D0039909270.pdf; Supplier: LCSC; Voltage Rated: 50V; Temperature Coefficient: C0G
C35 = 0603CG1R0C500NT: 容值:1pF;额定电压:50V;材质(温度系数):C0G;; LCSC Part Name: 1pF 50V; Supplier Part: C37117; Manufacturer: FH(风华); Supplier Footprint: 0603; JLCPCB Part Class: 扩展库; Datasheet: https://atta.szlcsc.com/upload/public/pdf/source/20200305/C486355_26A10D38EF8C2A5C37091D0039909270.pdf; Supplier: LCSC; Voltage Rated: 50V; Temperature Coefficient: C0G
C36 = 0603CG4R7C500NT: 容值:4.7pF;额定电压:50V;材质(温度系数):C0G;; LCSC Part Name: 4.7pF 50V; Supplier Part: C1669; Manufacturer: FH(风华); Supplier Footprint: 0603; JLCPCB Part Class: 扩展库; Datasheet: https://atta.szlcsc.com/upload/public/pdf/source/20200305/C486355_26A10D38EF8C2A5C37091D0039909270.pdf; Supplier: LCSC; Voltage Rated: 50V; Temperature Coefficient: C0G
C37 = 0603B222K500NT: 容值:2.2nF;精度:±10%;额定电压:50V;材质(温度系数):X7R;; LCSC Part Name: 2.2nF ±10% 50V; Supplier Part: C1604; Manufacturer: FH(风华); Supplier Footprint: 0603; JLCPCB Part Class: 基础库; Datasheet: https://atta.szlcsc.com/upload/public/pdf/source/20200305/C486355_26A10D38EF8C2A5C37091D0039909270.pdf; Supplier: LCSC; Tolerance: ±10%; Voltage Rated: 50V; Temperature Coefficient: X7R
C39 = CC0603KRX7R9BB102: 容值:1nF;精度:±10%;额定电压:50V;材质(温度系数):X7R;; LCSC Part Name: 1nF ±10% 50V; Supplier Part: C100040; Manufacturer: YAGEO(国巨); Supplier Footprint: 0603; JLCPCB Part Class: 扩展库; Datasheet: https://atta.szlcsc.com/upload/public/pdf/source/20180910/C282072_33301C7F631E79921B82A8DAC6BCC5B3.pdf; Supplier: LCSC; Tolerance: ±10%; Voltage Rated: 50V; Temperature Coefficient: X7R
L2 = VHF160808H8N2JT: 电感值:8.2nH;精度:±5%;额定电流:400mA;饱和电流(Isat):-;直流电阻(DCR):350mΩ;; LCSC Part Name: 8.2nH ±5%; Supplier Part: C90204; Manufacturer: FH(风华); Supplier Footprint: 0603; JLCPCB Part Class: 扩展库; Datasheet: https://atta.szlcsc.com/upload/public/pdf/source/20230223/8EF545BE87E825DABED9AF3380ABCE94.pdf; Supplier: LCSC; Tolerance: ±5%; Rated Current: 400mA; DC Resistance (DCR): 350mΩ
L3 = LQW18AN3N9C10D: 电感值:3.9nH;额定电流:1A;饱和电流(Isat):-;; Supplier Part: C521237; Manufacturer: muRata(村田); Supplier Footprint: 0603; JLCPCB Part Class: 扩展库; Datasheet: https://atta.szlcsc.com/upload/public/pdf/source/20181211/C341790_D709A266A9D251194E0E402A9D974B33.pdf; Supplier: LCSC; Rated Current: 1A; DC Resistance (DCR): 32mΩ
L4 = SCC1608C2N7SSP: 电感值:2.7nH;额定电流:500mA;饱和电流(Isat):-;直流电阻(DCR):200mΩ;; Supplier Part: C412027; Manufacturer: Sunltech(韩国顺磁); Supplier Footprint: 0603; JLCPCB Part Class: 扩展库; Datasheet: https://atta.szlcsc.com/upload/public/pdf/source/20190819/C412052_7E47CA9107AD18C13168C896A90007C8.pdf; Supplier: LCSC; Rated Current: 500mA; DC Resistance (DCR): 200mΩ
R34 = 0603WAF1501T5E: 电阻类型:厚膜电阻;阻值:1.5kΩ;精度:±1%;功率:100mW;最大工作电压:75V;温度系数:±100ppm/℃;; LCSC Part Name: 1.5kΩ ±1% 100mW 厚膜电阻; Supplier Part: C22843; Manufacturer: UNI-ROYAL(厚声); Supplier Footprint: 0603; JLCPCB Part Class: 基础库; Datasheet: https://atta.szlcsc.com/upload/public/pdf/source/20200306/C422600_1E6D84923E4A46A82E41ADD87F860B5C.pdf; Supplier: LCSC; Type: 厚膜电阻; Tolerance: ±1%; Power(Watts): 100mW; Overload Voltage (Max): 75V; Temperature Coefficient: ±100ppm/℃; Operating Temperature Range: -55℃~+155℃
R35 = 0603WAF2202T5E: 电阻类型:厚膜电阻;阻值:22kΩ;精度:±1%;功率:100mW;最大工作电压:75V;温度系数:±100ppm/℃;; LCSC Part Name: 22kΩ ±1% 100mW 厚膜电阻; Supplier Part: C31850; Manufacturer: UNI-ROYAL(厚声); Supplier Footprint: 0603; JLCPCB Part Class: 基础库; Datasheet: https://atta.szlcsc.com/upload/public/pdf/source/20200306/C422600_1E6D84923E4A46A82E41ADD87F860B5C.pdf; Supplier: LCSC; Type: 厚膜电阻; Tolerance: ±1%; Power(Watts): 100mW; Overload Voltage (Max): 75V; Temperature Coefficient: ±100ppm/℃; Operating Temperature Range: -55℃~+155℃
R36 = SC0603F1004F2BNRH: 阻值:1MΩ;精度:±1%;功率:-;温度系数:±100ppm/℃;; LCSC Part Name: 1MΩ ±1%; Supplier Part: C3152128; Manufacturer: Sunway(信维通信); Supplier Footprint: 0603; JLCPCB Part Class: 扩展库; Datasheet: https://atta.szlcsc.com/upload/public/pdf/source/20220728/FFCE43BB6DF8FA16AEE331F0F4B289DE.pdf; Supplier: LCSC; Tolerance: ±1%; Temperature Coefficient: ±100ppm/℃
SW1 = THB001P: 带有多功能, 高质量的双轴杠杆和集成的中心选择开关 适用于航模玩具遥控器电位器、3D摇杆PS4手柄游戏机、无人机摇杆电位器、工业控制器; LCSC Part Name: 微型指拨摇杆开关; Supplier Part: C2685355; Manufacturer: C&K; Supplier Footprint: 插件-14P,17x21mm; JLCPCB Part Class: 扩展库; Datasheet: https://atta.szlcsc.com/upload/public/pdf/source/20210114/C2685355_98E98C84804317E8B305B6FAD3A93D12.pdf; Supplier: LCSC
SW2 = EC11E15244B2_C470754: Supplier Part: C470754; Manufacturer: ALPSALPINE(阿尔卑斯阿尔派); Supplier Footprint: 插件; JLCPCB Part Class: 扩展库; Datasheet: https://atta.szlcsc.com/upload/public/pdf/source/20191216/C470795_DE763ECE59BD49533DB26DB53E5D34B2.pdf; Supplier: LCSC
U8 = NRF24L01P-R: 频率范围:2.4GHz;接口:SPI;应用领域:通用 ISM>1GHz;数据速率:2Mbps;灵敏度:-94dBm;典型应用频率:2.4GHz;; LCSC Part Name: 单芯片2.4GHz收发器; Supplier Part: C8791; Manufacturer: NORDIC; Supplier Footprint: QFN-20-EP(4x4); JLCPCB Part Class: 扩展库; Datasheet: https://atta.szlcsc.com/upload/public/pdf/source/20120816/1457706530106.pdf; Supplier: LCSC; Frequency Range: 2.4GHz; Interface: SPI; Operating Voltage: 1.9V~3.6V; Applications: 通用 ISM>1GHz; Output Power: 0dBm; Data Rate: 2Mbps; Current Of Transmitting: 7mA; Sensitivity: -94dBm; Receive Current: 12.6mA; Typical Application Frequency: 2.4GHz; Operating Temperature: -40℃~+85℃
USB1 = TYPEC-304J-BCP16: 连接器类型:Type-C;标准:USB 3.1;公母:母座;触点数量:16;端口数量:1;安装方式:卧贴;额定电流 - 电源:5A;工作温度范围:-40℃~+85℃;焊接温度(最大值):260℃;; LCSC Part Name: Type-C 母座 卧贴 脚长2.0; Supplier Part: C2835315; Manufacturer: XUNPU(讯普); Supplier Footprint: SMD,8.94x7.35x3.16mm; JLCPCB Part Class: 扩展库; Supplier: LCSC; Connector Type: Type-C; Standard: USB 3.1; Gender: 母座; Number of Contacts: 16; Number of Ports: 1; Mounting Style: 卧贴; Current Rating - Power (Max): 5A; Operating Temperature Range: -40℃~+85℃; Welding Temperature (Max): 260℃
X5 = XL7EL89COI-111YLC-16M: 晶振类型:贴片晶振;频率:16MHz;常温频差:±10ppm;外接负载电容:12pF;频率稳定度(全温):±20ppm;; LCSC Part Name: 16MHz ±10ppm 12pF; Supplier Part: C2965579; Manufacturer: YXC(扬兴晶振); Supplier Footprint: SMD2016-4P; JLCPCB Part Class: 扩展库; Datasheet: https://atta.szlcsc.com/upload/public/pdf/source/20220121/6B4B3E7EF7974858943D806BF8CACEA3.pdf; Supplier: LCSC; Crystal Type: 贴片晶振; Normal temperature Frequency Tolerance: ±10ppm; External load capacitor: 12pF; Frequency Stability(Full temperature range): ±20ppm; Operating Temperature: -40℃~+85℃

## Nets
3V3: C16.1 C23.1 C24.1 C25.1 C26.1 C27.2 C30.1 C38.1 C39.1 D9.1(C) J1.9 J1.12 L1.2 R15.1 R34.1 SWD1.1 TP2_3V3.1 U1.1(VBAT) U1.19(VDD) U1.32(VDD) U1.48(VDD) U1.64(VDD) U3.2 U4.2(VOUT) U4.4(VOUT) U5.2 U8.7(VDD) U8.15(VDD) U8.18(VDD)
+5V: C22.1 D1.1(K) R17.1 TP1_5V.1 U4.3(VIN) U5.1 USB1.A4B9(VBUS) USB1.B4A9(VBUS)
AGND: C17.2 J1.8(CHS GND) J1.SH1 J1.SH2
AVDD: C3.2 C4.2 C5.2 C6.2 C7.2 C8.2 C15.1 R11.2 R13.2 R14.1 U2.4(AVDD) U2.8(AVDD) U2.11(AVDD) U2.15(AVDD) U2.17(AVDD) U2.21(AVDD) U3.1
GND: C1.2 C2.1 C3.1 C4.1 C5.1 C6.1 C7.1 C8.1 C9.1 C10.1 C11.2 C14.2 C15.2 C16.2 C17.1 C18.1 C19.1 C20.2 C21.2 C22.2 C23.2 C24.2 C25.2 C26.2 C27.1 C28.2 C29.2 C30.2 C31.2 C32.2 C33.2 C35.2 C36.2 C37.2 C38.2 C39.2 D1.2(A) LED_POWER.2(-) R3.2 R16.2 R35.2 SWD1.4 TP3_GND.1 U1.12(VSSAVREF-) U1.18(VSS) U1.31(VSS) U1.47(VSS) U1.63(VSS) U2.3(AGND) U2.9(AGND) U2.14(AGND) U2.16(AGND) U2.19(AGND) U2.23(RSVD) U2.29(GND) U2.38(RSVD) U2.39(RSVD) U2.40(RSVD) U2.41(RSVD) U2.42(RSVD) U2.48(AGND) U4.1(ADJ/GND) U5.5 U8.8(VSS) U8.14(VSS) U8.17(VSS) U8.20(VSS) U8.21(EP) USB1.13(GND) USB1.14(GND) USB1.15(GND) USB1.16(GND) USB1.A1B12(GND) USB1.B1A12(GND) X3.2(GND) X3.4(GND) X4.2(GND) X4.4(GND) X5.2(GND) X5.4(GND)
VBAT: D9.2(A)
VCC: U2.28(VDD)
VDDA: C28.1 C29.1 L1.1 U1.13(VDDAVREF+)
ANT: C34.2 C35.1 TP4_ANT1.1
NRF24L01_ANT1: L2.2 L4.1 U8.12(ANT1)
NRF24L01_ANT2: L2.1 L3.1 U8.13(ANT2)
NRF24L01_CE: U8.1(CE)
NRF24L01_CSN: U8.2(CSN)
NRF24L01_DVDD: C33.1 U8.19(DVDD)
NRF24L01_IREF: R35.1 U8.16(IREF)
NRF24L01_IRQ: U8.6(IRQ)
NRF24L01_MISO: U8.5(MISO)
NRF24L01_MOSI: U8.4(MOSI)
NRF24L01_SCK: U8.3(SCK)
NRF24L01_VDD_PA: C36.1 C37.1 L4.2 U8.11(VDD_PA)
NRF24L01_XC1: C32.1 R36.2 U8.10(XC1) X5.3
NRF24L01_XC2: C31.1 R36.1 U8.9(XC2) X5.1
OSC32_IN: C20.1 U1.3(PC14-OSC32_IN) X1.1
OSC32_OUT: C21.1 U1.4(PC15-OSC32_OUT) X1.2
OSC_IN: C19.2 U1.5(PH0-OSC_IN) X4.3
OSC_OUT: C18.2 U1.6(PH1-OSC_OUT) X4.1
RJ45_G_LED: R4.1 U2.25(LINKLED)
RJ45_RCT: C11.1 J1.5 R10.1 R12.1
RJ45_RD+: C13.2 J1.3(RD+)
RJ45_RD-: C12.2 J1.6(RD-)
RJ45_TCT: C14.1 J1.4 R14.2
RJ45_TD+: J1.1(TD+) R9.2 R11.1
RJ45_TD-: J1.2(TD-) R8.2 R13.1
RJ45_Y_LED: R5.1 U2.27(ACTLED)
STM32_PA0: U1.14(PA0-WKUP)
STM32_PA1: U1.15(PA1)
STM32_PA2: U1.16(PA2)
STM32_PA3: U1.17(PA3)
STM32_PA4: U1.20(PA4)
STM32_PA5: U1.21(PA5)
STM32_PA6: U1.22(PA6)
STM32_PA7: U1.23(PA7)
STM32_PA8: U1.41(PA8)
STM32_PA9: U1.42(PA9)
STM32_PA10: U1.43(PA10)
STM32_PA11: U1.44(PA11) USB1.A7(DN1) USB1.B7(DN2)
STM32_PA12: R34.2 U1.45(PA12) USB1.A6(DP1) USB1.B6(DP2)
STM32_PA13: R15.2 SWD1.2 U1.46(PA13)
STM32_PA14: R16.1 SWD1.3 U1.49(PA14)
STM32_PB0: U1.26(PB0)
STM32_PB1: U1.27(PB1)
STM32_PB2: U1.28(PB2)
STM32_PB3: U1.55(PB3)
STM32_PB4: U1.56(PB4)
STM32_PB5: U1.57(PB5)
STM32_PB6: U1.58(PB6)
STM32_PB7: U1.59(PB7)
STM32_PB8: U1.61(PB8)
STM32_PB9: U1.62(PB9)
STM32_PB10: U1.29(PB10)
STM32_PB12: U1.33(PB12)
STM32_PB13: U1.34(PB13)
STM32_PB14: U1.35(PB14)
STM32_PB15: U1.36(PB15)
STM32_PD2: U1.54(PD2)
USART1_RX: U5.3
USART1_TX: U5.4
W5500_1V2O: C10.2 U2.22(1V2O)
W5500_DUPLED: U2.26(DUPLED)
W5500_EXRES1: R3.1 U2.10(EXRES1)
W5500_INTN: U2.36(INTn)
W5500_MISO: U2.34(MISO)
W5500_MOSI: U2.35(MOSI)
W5500_PMODE0: U2.45(PMODE0)
W5500_PMODE1: U2.44(PMODE1)
W5500_PMODE2: U2.43(PMODE2)
W5500_RSTN: U2.37(RSTn)
W5500_RX+: R7.1 U2.6(RXP)
W5500_RX-: R6.1 U2.5(RXN)
W5500_SCLK: U2.33(SCLK)
W5500_SCSN: U2.32(SCSn)
W5500_SPDLED: U2.24(SPDLED)
W5500_TOCAP: C9.2 U2.20(TOCAP)
W5500_TX+: R9.1 U2.2(TXP)
W5500_TX-: R8.1 U2.1(TXN)
W5500_XI: C1.1 R1.2 U2.30(XI/CLKIN) X3.1
W5500_XO: R1.1 R2.1 U2.31(XO)
$1N1595: LED_POWER.1(+) R17.2
$2N1049: C2.2 R2.2 X3.3
$2N2710: J1.10 R4.2
$2N2712: J1.11 R5.2
$2N3601: C12.1 R6.2 R12.2
$2N3646: C13.1 R7.2 R10.2
Net-(C34-1): C34.1 L3.2

Not connected (* = marked no-connect by the designer): J1 7(NC)*; SW1 1(B) 2(DTA) 3(A) 4(A) 5(DTA) 6(B) 7(GND) 8(GND) 9(GND) 10(GND) a b c d; SW2 6 7 A B C D E; U1 2(PC13-ANTI_TAMP) 7(NRST) 8(PC0) 9(PC1) 10(PC2) 11(PC3) 24(PC4) 25(PC5) 30(VCAP1) 37(PC6) 38(PC7) 39(PC8) 40(PC9) 50(PA15) 51(PC10) 52(PC11) 53(PC12) 60(BOOT0); U2 7(DNC)* 12(NC)* 13(NC)* 18(VBG)* 46(NC)* 47(NC)*; USB1 A5(CC1)* A8(SBU1)* B5(CC2)* B8(SBU2)*

## Notes on the sheets
sheet 1
- 下载调试电路
- 主控
- 晶振电路
- 电源电路
sheet 2
- W5500 与 RJ45 数字与模拟接入电路
- W5500 与 RJ45 变压器 电路
- W5500 主电路
- W5500晶振
- W5500旁路
sheet 3
- USB TYPE C 母口
- NRF24L01 电路
- 摇杆
- 编码旋钮
